# EAGLE schematic Dual Motor Driver (EAGLE 6.4)
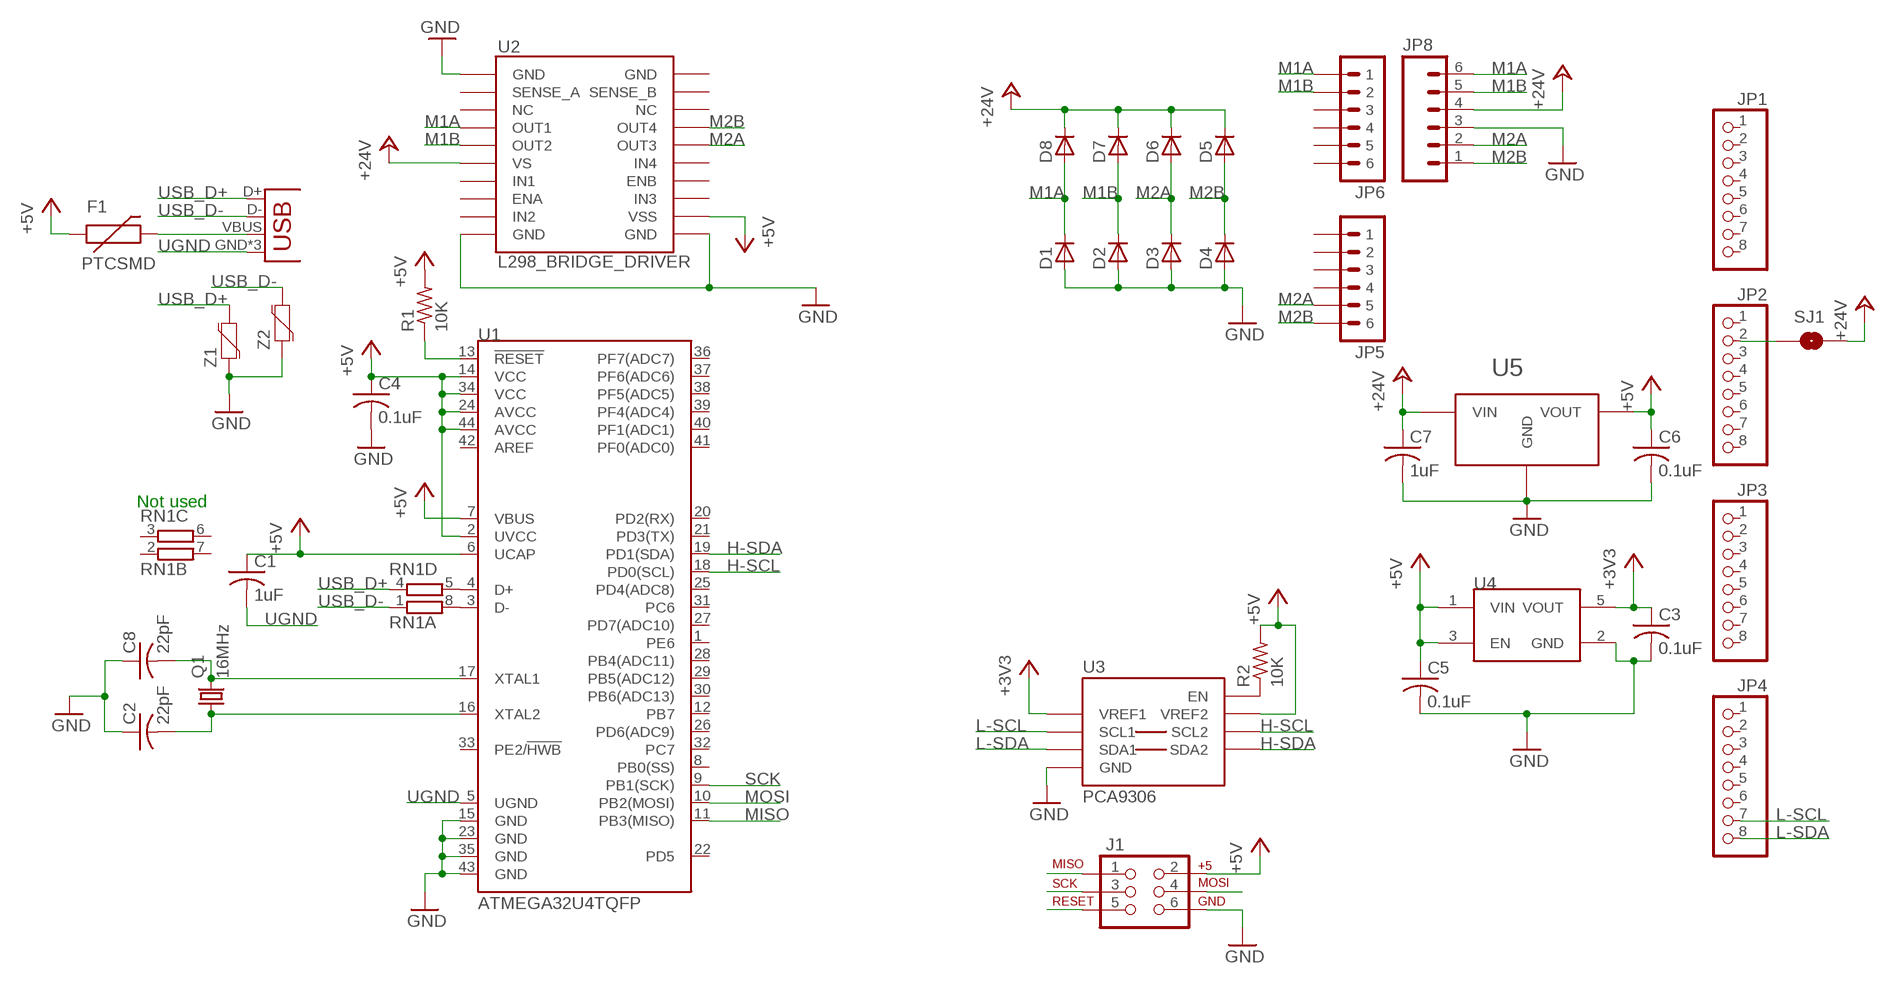
[diagram p0: schematic, sheet 1]

## Parts
C1  1uF  C-USC0603  [C0603]
C2  22pF  C-USC0603  [C0603]
C3  0.1uF  C-USC0603  [C0603]
C4  0.1uF  C-USC0603  [C0603]
C5  0.1uF  C-USC0603  [C0603]
C6  0.1uF  C-USC0603  [C0603]
C7  1uF  C-USC0603  [C0603]
C8  22pF  C-USC0603  [C0603]
D1  D-SOD123  [SOD123]
D2  D-SOD123  [SOD123]
D3  D-SOD123  [SOD123]
D4  D-SOD123  [SOD123]
D5  D-SOD123  [SOD123]
D6  D-SOD123  [SOD123]
D7  D-SOD123  [SOD123]
D8  D-SOD123  [SOD123]
F1  PTCSMD  [PTC-1206]
J1  AVR_SPI_PRG_6PTH  [2X3]
JP1  PINHD-1X81X08_NO_SILK  [1X08_NO_SS]
JP2  PINHD-1X81X08_NO_SILK  [1X08_NO_SS]
JP3  PINHD-1X81X08_NO_SILK  [1X08_NO_SS]
JP4  PINHD-1X81X08_NO_SILK  [1X08_NO_SS]
JP5  6PIN-SH_RIGHT_ANGLE  [6PIN-SH_SERIES_RA]
JP6  6PIN-SH_RIGHT_ANGLE  [6PIN-SH_SERIES_RA]
JP7  USB-MICROB  [USB-MICROB]
JP8  M063.5MM-6  [SCREWTERMINAL-3.5MM-6]
Q1  16MHz  CRYSTALCTS406  [CTS406]
R1  10K  R-US_R0603  [R0603]
R2  10K  R-US_R0603  [R0603]
RN1  4R-N0603-ARV  [0603-ARV]
SJ1  SOLDERJUMPERNC  [SJ_2S]
U1  ATMEGA32U4TQFP  [SPARKFUN-DIGITALIC_TQFP44]
U2  L298_BRIDGE_DRIVER  [POWERSO20]
U3  PCA9306  [SOIC-8]
U4  TLV71333PDBVR  ADP160  [SOT23-5]
U5  VOLTAGE-REGULATOR  [SOT89]
Z1  VARISTOR-0603  [0603-RES]
Z2  VARISTOR-0603  [0603-RES]

## Nets
+3V3: C3.1 U3.P$2(VREF1) U4.5(VOUT)
+5V: C1.1 C4.1 C5.1 C6.1 F1.1 J1.2 R1.2 R2.2 U1.2(UVCC) U1.6(UCAP) U1.7(VBUS) U1.14(VCC) U1.24(AVCC) U1.34(VCC) U1.44(AVCC) U2.12(VSS) U3.P$7(VREF2) U4.1(VIN) U4.3(EN) U5.P$1(VOUT)
+24V: C7.1 D5.1(C) D6.1(C) D7.1(C) D8.1(C) JP8.4 SJ1.2 U2.6(VS) U5.P$3(VIN)
GND: C2.1 C3.2 C4.2 C5.2 C6.2 C7.2 C8.1 D1.2(A) D2.2(A) D3.2(A) D4.2(A) J1.6 JP8.3 U1.15(GND) U1.23(GND) U1.35(GND) U1.43(GND) U2.1(GND) U2.10(GND) U2.11(GND) U3.P$1(GND) U4.2(GND) U5.P$2(GND) U5.P$4(GND) Z1.1 Z2.1
H-SCL: U1.18(PD0(SCL)) U3.P$6(SCL2)
H-SDA: U1.19(PD1(SDA)) U3.P$5(SDA2)
L-SCL: JP4.7 U3.P$3(SCL1)
L-SDA: JP4.8 U3.P$4(SDA1)
M1A: D1.1(C) D8.2(A) JP6.P$1 JP8.6 U2.4(OUT1)
M1B: D2.1(C) D7.2(A) JP6.P$2 JP8.5 U2.5(OUT2)
M2A: D3.1(C) D6.2(A) JP5.P$5 JP8.2 U2.16(OUT3)
M2B: D4.1(C) D5.2(A) JP5.P$6 JP8.1 U2.17(OUT4)
MISO: J1.1 U1.11(PB3(MISO))
MOSI: J1.4 U1.10(PB2(MOSI))
N$1: RN1.5 U1.4(D+)
N$2: RN1.8 U1.3(D-)
N$3: R2.1 U3.P$8(EN)
N$4: F1.2 JP7.VBUS
N$5: JP2.2 SJ1.1
N$6: C8.2 Q1.3 U1.17(XTAL1)
N$7: C2.2 Q1.1 U1.16(XTAL2)
RESET: J1.5 R1.1 U1.13(!RESET)
SCK: J1.3 U1.9(PB1(SCK))
UGND: C1.2 JP7.GND JP7.MT1(GND) JP7.MT2(GND) U1.5(UGND)
USB_D+: JP7.D+ RN1.4 Z1.2
USB_D-: JP7.D- RN1.1 Z2.2
Unconnected: JP1.1 JP1.2 JP1.3 JP1.4 JP1.5 JP1.6 JP1.7 JP1.8 JP2.1 JP2.3 JP2.4 JP2.5 JP2.6 JP2.7 JP2.8 JP3.1 JP3.2 JP3.3 JP3.4 JP3.5 JP3.6 JP3.7 JP3.8 JP4.1 JP4.2 JP4.3 JP4.4 JP4.5 JP4.6 JP5.P$1 JP5.P$2 JP5.P$3 JP5.P$4 JP6.P$3 JP6.P$4 JP6.P$5 JP6.P$6 RN1.2 RN1.3 RN1.6 RN1.7 U1.1(PE6) U1.8(PB0(SS)) U1.12(PB7) U1.20(PD2(RX)) U1.21(PD3(TX)) U1.22(PD5) U1.25(PD4(ADC8)) U1.26(PD6(ADC9)) U1.27(PD7(ADC10)) U1.28(PB4(ADC11)) U1.29(PB5(ADC12)) U1.30(PB6(ADC13)) U1.31(PC6) U1.32(PC7) U1.33(PE2/!HWB) U1.36(PF7(ADC7)) U1.37(PF6(ADC6)) U1.38(PF5(ADC5)) U1.39(PF4(ADC4)) U1.40(PF1(ADC1)) U1.41(PF0(ADC0)) U1.42(AREF) U2.2(SENSE_A) U2.3(NC) U2.7(IN1) U2.8(ENA) U2.9(IN2) U2.13(IN3) U2.14(ENB) U2.15(IN4) U2.18(NC) U2.19(SENSE_B) U2.20(GND)

## Notes on the sheet
- Not used

## Library data of the parts
C1-C8 = resistor:C-US: CAPACITOR, American symbol
D1-D8 = semicon-smd-ipc:D-: DIODE unfilled; PART#: CDBW140-G
F1 = SparkFun-PowerIC:PTC: Resettable Fuse PTC Resettable Fuse. Spark Fun Electronics SKU : COM-08357; PART#: 0ZCJ0050FF2G
J1 = SparkFun-Connectors:AVR_SPI_PRG_6: AVR ISP 6 Pin This is the reduced ISP connector for AVR programming. Common on Arduino. This footprint will take up less PCB space and can be used with a 10-pin to 6-pin adapter such as SKU: BOB-08508
JP1-JP4 = pinhead:PINHD-1X8: PIN HEADER
JP5 JP6 = con-jst:6PIN-SH; PART#: SM06B-SRSS-TB(LF)(SN)
JP7 = SparkFun-Connectors:USB: USB Connectors USB-B-PTH is fully proven SKU : PRT-00139/CONN-08278 USB-miniB is fully proven SKU : PRT-00587 USB-A-PCB is untested. USB-A-H is throughly reviewed, but untested. Spark Fun Electronics SKU : PRT-00437 USB-B-SMT is throughly reviewed, but untested. Needs silkscreen touching up. USB-A-S has not been used/tested USB-MB-H has not been used/tested USB-MICROB has been used. CONN-09505; PROD_ID: CONN-09505
JP8 = SparkFun-Connectors:M06: Header 6 Standard 6-pin 0.1" header. Use with straight break away headers (SKU : PRT-00116), right angle break away headers (PRT-00553), swiss pins (PRT-00743), machine pins (PRT-00117), and female headers (PRT-00115). Molex polarized connector foot print use with SKU : PRT-08094 with associated crimp pins and housings. NOTES ON THE VARIANTS LOCK and LOCK_LONGPADS... This footprint was designed to help hold the alignment of a through-hole component (i.e. 6-pin header) while soldering it into place. You may notice that each hole has been shifted either up or down by 0.005 of an inch from it's more standard position (which is a perfectly straight line). This slight alteration caused the pins (the squares in the middle) to touch the edges of the holes. Because they are alternating, it causes a "brace" to hold the component in place. 0.005 has proven to be the perfect amount of "off-center" position when using our standard breakaway headers. Although looks a little odd when you look at the bare footprint, once you have a header in there, the alteration is very hard to notice. Also, if you push a header all the way into place, it is covered up entirely on the bottom side. This idea of altering the position of holes to aid alignment will be further integrated into the Sparkfun Library for other footprints. It can help hold any component with 3 or more connection pins.
Q1 = crystal:CRYSTAL: CRYSTAL; OC_FARNELL: unknown; OC_NEWARK: unknown; PART#: 406C35D16M00000
R1 R2 = resistor:R-US_: RESISTOR, American symbol
RN1 = resistor-dil:4R-N: Array Chip Resistor Source: RS Component / Phycomp; OC_FARNELL: unknown; OC_NEWARK: unknown
SJ1 = SparkFun-Passives:SOLDERJUMPER: Solder Jumper Standard SMD solder jumper. Used to automate production. Two varients : Normally Open and Normally Closed are the same, but have different paste layers. NC will have a large amount of paste and should jumper during reflow.
U1 = SparkFun-DigitalIC:ATMEGA32U4: Atmel 44-pin 8-bit Microcontroller with 32KBytes of ISP Flash and USB Controller
U2 = SparkFun-PowerIC:L298_BRIDGE_DRIVER: Full-bridge power driver IC
U3 = My Parts:PCA9306; PART#: PCA9306D,118
U4 = SparkFun-PowerIC:ADP160: Nanopower LDO Iq less than 1uA for low Iload; PART#: TLV71333PDBVR; PROD_ID: VREG-11306; VALUE: ADP160
U5 = My Parts:VOLTAGE-REGULATOR; PART#: L78L05ACUTR
Z1 Z2 = SparkFun-DiscreteSemi:VARISTOR: Varistor Varistor (Variable resistor) is a nonlinear resistive element of the voltage dependence that resistance changes with applied voltage. Varistor is equivalent with Zener diode of two series connection.; PART#: CG0603MLC-05E